# Altium schematic sheet 02)CPU-2.SchDoc
size 297 x 209 mm
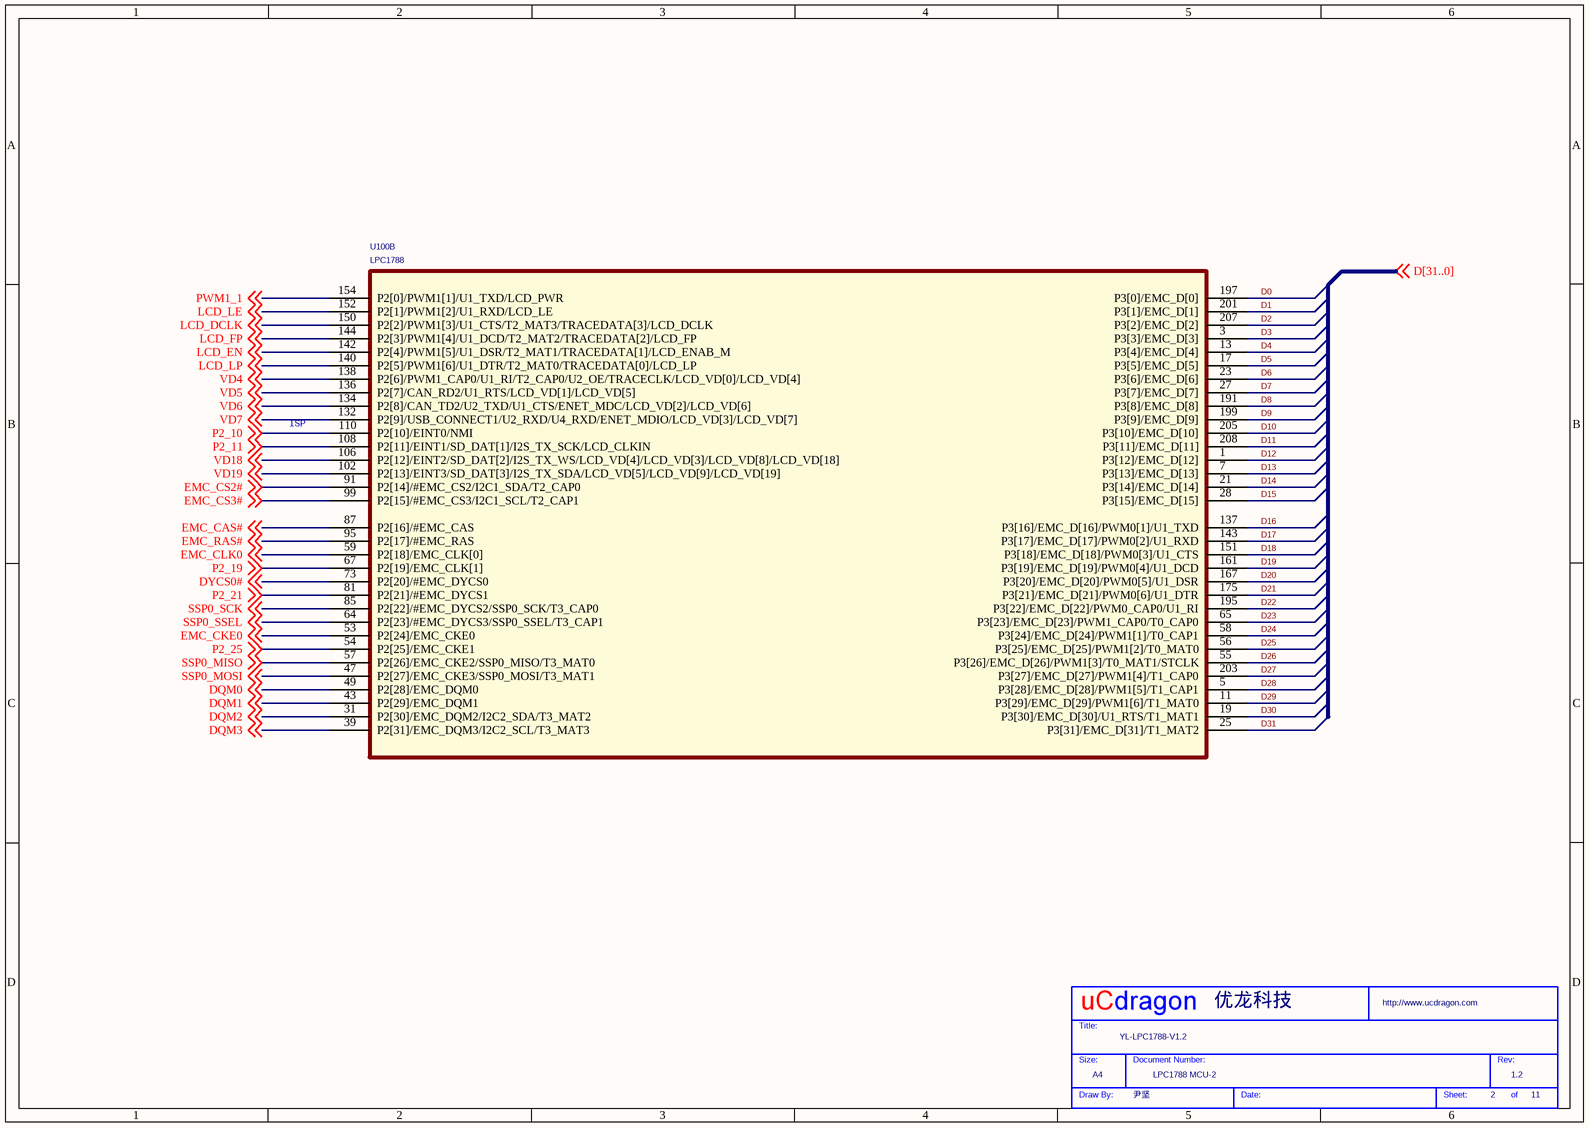
[diagram p0: 02)CPU-2.SchDoc]

## Parts
*  Page Count: 11  Page Number: 2  Page Size: A4  Title: YL-LPC1788-V1.2  RevCode: 1.2  Doc: LPC1788 MCU-2  Drawing: 尹坚  Company: 优龙科技  (hidden comment: My Title 0)  (graphical)
U100  LPC1788  [LQFP208_28X28X05P]  (part B of 3)

## Nets
D0: U100.197(P3[0]/EMC_D[0])
D1: U100.201(P3[1]/EMC_D[1])
D2: U100.207(P3[2]/EMC_D[2])
D3: U100.3(P3[3]/EMC_D[3])
D4: U100.13(P3[4]/EMC_D[4])
D5: U100.17(P3[5]/EMC_D[5])
D6: U100.23(P3[6]/EMC_D[6])
D7: U100.27(P3[7]/EMC_D[7])
D8: U100.191(P3[8]/EMC_D[8])
D9: U100.199(P3[9]/EMC_D[9])
D10: U100.205(P3[10]/EMC_D[10])
D11: U100.208(P3[11]/EMC_D[11])
D12: U100.1(P3[12]/EMC_D[12])
D13: U100.7(P3[13]/EMC_D[13])
D14: U100.21(P3[14]/EMC_D[14])
D15: U100.28(P3[15]/EMC_D[15])
D16: U100.137(P3[16]/EMC_D[16]/PWM0[1]/U1_TXD)
D17: U100.143(P3[17]/EMC_D[17]/PWM0[2]/U1_RXD)
D18: U100.151(P3[18]/EMC_D[18]/PWM0[3]/U1_CTS)
D19: U100.161(P3[19]/EMC_D[19]/PWM0[4]/U1_DCD)
D20: U100.167(P3[20]/EMC_D[20]/PWM0[5]/U1_DSR)
D21: U100.175(P3[21]/EMC_D[21]/PWM0[6]/U1_DTR)
D22: U100.195(P3[22]/EMC_D[22]/PWM0_CAP0/U1_RI)
D23: U100.65(P3[23]/EMC_D[23]/PWM1_CAP0/T0_CAP0)
D24: U100.58(P3[24]/EMC_D[24]/PWM1[1]/T0_CAP1)
D25: U100.56(P3[25]/EMC_D[25]/PWM1[2]/T0_MAT0)
D26: U100.55(P3[26]/EMC_D[26]/PWM1[3]/T0_MAT1/STCLK)
D27: U100.203(P3[27]/EMC_D[27]/PWM1[4]/T1_CAP0)
D28: U100.5(P3[28]/EMC_D[28]/PWM1[5]/T1_CAP1)
D29: U100.11(P3[29]/EMC_D[29]/PWM1[6]/T1_MAT0)
D30: U100.19(P3[30]/EMC_D[30]/U1_RTS/T1_MAT1)
D31: U100.25(P3[31]/EMC_D[31]/T1_MAT2)
DQM0: U100.49(P2[28]/EMC_DQM0) ; off-sheet DQM0
DQM1: U100.43(P2[29]/EMC_DQM1) ; off-sheet DQM1
DQM2: U100.31(P2[30]/EMC_DQM2/I2C2_SDA/T3_MAT2) ; off-sheet DQM2
DQM3: U100.39(P2[31]/EMC_DQM3/I2C2_SCL/T3_MAT3) ; off-sheet DQM3
DYCS0#: U100.73(P2[20]/#EMC_DYCS0) ; off-sheet DYCS0#
EMC_CAS#: U100.87(P2[16]/#EMC_CAS) ; off-sheet EMC_CAS#
EMC_CKE0: U100.53(P2[24]/EMC_CKE0) ; off-sheet EMC_CKE0
EMC_CLK0: U100.59(P2[18]/EMC_CLK[0]) ; off-sheet EMC_CLK0
EMC_CS2#: U100.91(P2[14]/#EMC_CS2/I2C1_SDA/T2_CAP0) ; off-sheet EMC_CS2#
EMC_CS3#: U100.99(P2[15]/#EMC_CS3/I2C1_SCL/T2_CAP1) ; off-sheet EMC_CS3#
EMC_RAS#: U100.95(P2[17]/#EMC_RAS) ; off-sheet EMC_RAS#
LCD_DCLK: U100.150(P2[2]/PWM1[3]/U1_CTS/T2_MAT3/TRACEDATA[3]/LCD_DCLK) ; off-sheet LCD_DCLK
LCD_EN: U100.142(P2[4]/PWM1[5]/U1_DSR/T2_MAT1/TRACEDATA[1]/LCD_ENAB_M) ; off-sheet LCD_EN
LCD_FP: U100.144(P2[3]/PWM1[4]/U1_DCD/T2_MAT2/TRACEDATA[2]/LCD_FP) ; off-sheet LCD_FP
LCD_LE: U100.152(P2[1]/PWM1[2]/U1_RXD/LCD_LE) ; off-sheet LCD_LE
LCD_LP: U100.140(P2[5]/PWM1[6]/U1_DTR/T2_MAT0/TRACEDATA[0]/LCD_LP) ; off-sheet LCD_LP
P2_10: U100.110(P2[10]/EINT0/NMI) ; off-sheet P2_10
P2_11: U100.108(P2[11]/EINT1/SD_DAT[1]/I2S_TX_SCK/LCD_CLKIN) ; off-sheet P2_11
P2_19: U100.67(P2[19]/EMC_CLK[1]) ; off-sheet P2_19
P2_21: U100.81(P2[21]/#EMC_DYCS1) ; off-sheet P2_21
P2_25: U100.54(P2[25]/EMC_CKE1) ; off-sheet P2_25
PWM1_1: U100.154(P2[0]/PWM1[1]/U1_TXD/LCD_PWR) ; off-sheet PWM1_1
SSP0_MISO: U100.57(P2[26]/EMC_CKE2/SSP0_MISO/T3_MAT0) ; off-sheet SSP0_MISO
SSP0_MOSI: U100.47(P2[27]/EMC_CKE3/SSP0_MOSI/T3_MAT1) ; off-sheet SSP0_MOSI
SSP0_SCK: U100.85(P2[22]/#EMC_DYCS2/SSP0_SCK/T3_CAP0) ; off-sheet SSP0_SCK
SSP0_SSEL: U100.64(P2[23]/#EMC_DYCS3/SSP0_SSEL/T3_CAP1) ; off-sheet SSP0_SSEL
VD4: U100.138(P2[6]/PWM1_CAP0/U1_RI/T2_CAP0/U2_OE/TRACECLK/LCD_VD[0]/LCD_VD[4]) ; off-sheet VD4
VD5: U100.136(P2[7]/CAN_RD2/U1_RTS/LCD_VD[1]/LCD_VD[5]) ; off-sheet VD5
VD6: U100.134(P2[8]/CAN_TD2/U2_TXD/U1_CTS/ENET_MDC/LCD_VD[2]/LCD_VD[6]) ; off-sheet VD6
VD7: U100.132(P2[9]/USB_CONNECT1/U2_RXD/U4_RXD/ENET_MDIO/LCD_VD[3]/LCD_VD[7]) ; off-sheet VD7
VD18: U100.106(P2[12]/EINT2/SD_DAT[2]/I2S_TX_WS/LCD_VD[4]/LCD_VD[3]/LCD_VD[8]/LCD_VD[18]) ; off-sheet VD18
VD19: U100.102(P2[13]/EINT3/SD_DAT[3]/I2S_TX_SDA/LCD_VD[5]/LCD_VD[9]/LCD_VD[19]) ; off-sheet VD19

## Notes on the sheet
- ISP
- (in symbol My Title 0) Title:; Size:; Document Number:; Rev:; Draw By:; Date:; Sheet:; of

## Library data of the parts
* = My Title 0: Page Create Date: May 29, 2006; WebSite: http://www.ucdragon.com